# Altium schematic sheet Core48.SchDoc
size A4
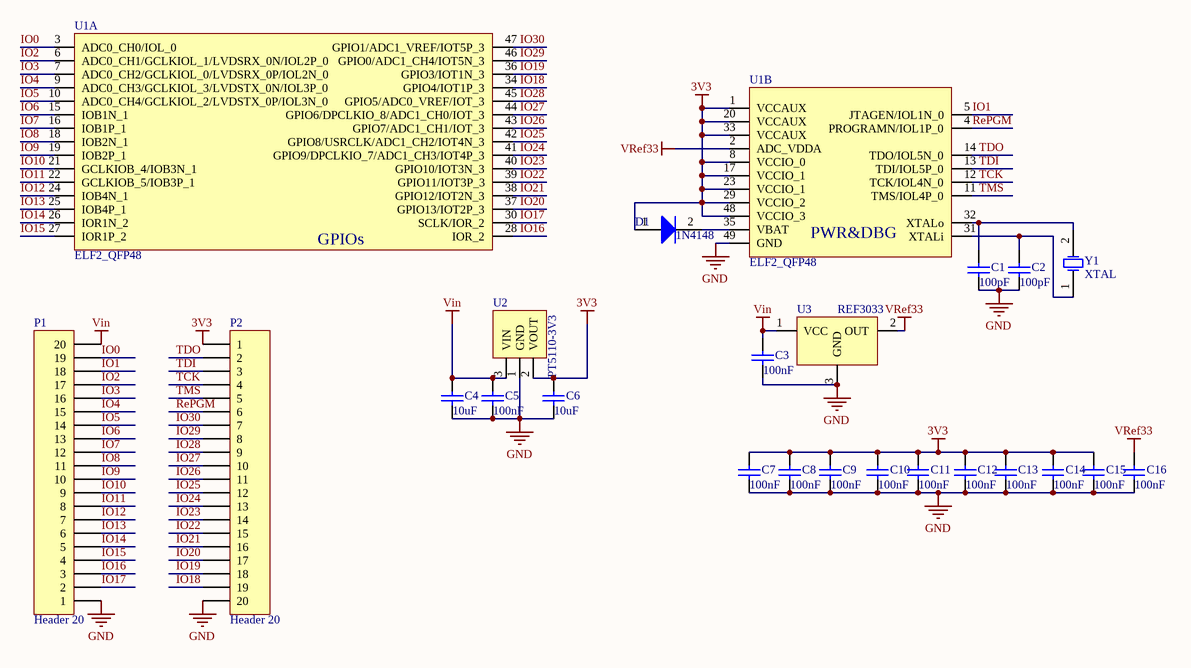
[diagram p0: Core48.SchDoc]

## Parts
C1  value 100pF  [0603C]  (hidden comment: Cap)
C2  value 100pF  [0603C]  (hidden comment: Cap)
C3  value 100nF  [0603C]  (hidden comment: Cap)
C4  value 10uF  [0603C]  (hidden comment: Cap)
C5  value 100nF  [0603C]  (hidden comment: Cap)
C6  value 10uF  [0603C]  (hidden comment: Cap)
C7  value 100nF  [0603C]  (hidden comment: Cap)
C8  value 100nF  [0603C]  (hidden comment: Cap)
C9  value 100nF  [0603C]  (hidden comment: Cap)
C10  value 100nF  [0603C]  (hidden comment: Cap)
C11  value 100nF  [0603C]  (hidden comment: Cap)
C12  value 100nF  [0603C]  (hidden comment: Cap)
C13  value 100nF  [0603C]  (hidden comment: Cap)
C14  value 100nF  [0603C]  (hidden comment: Cap)
C15  value 100nF  [0603C]  (hidden comment: Cap)
C16  value 100nF  [0603C]  (hidden comment: Cap)
D1  1N4148  [6-0805_Diode]
P1  Header 20  [HDR1X20]
P2  Header 20  [HDR1X20]
U1  ELF2_QFP48  [TSQFP48-7*7]  (parts A,B of 2)
U2  PT5110-3V3  [SOT-89-3]
U3  REF3033  [SOT23]
Y1  XTAL  [XTAL-5032]

## Nets
3V3: C6.2 C7.2 C8.2 C9.2 C10.2 C11.2 C12.2 C13.2 C14.2 C15.2 D1.1(A) P2.1 U1.1(VCCAUX) U1.8(VCCIO_0) U1.17(VCCIO_1) U1.20(VCCAUX) U1.23(VCCIO_1) U1.29(VCCIO_2) U1.33(VCCAUX) U1.48(VCCIO_3) U2.2(VOUT)
GND: C1.1 C2.1 C3.1 C4.1 C5.1 C6.1 C7.1 C8.1 C9.1 C10.1 C11.1 C12.1 C13.1 C14.1 C15.1 C16.1 P1.1 P2.20 U1.49(GND) U2.1(GND) U3.3(GND)
Vin: C3.2 C4.2 C5.2 P1.20 U2.3(VIN) U3.1(VCC)
VRef33: C16.2 U1.2(ADC_VDDA) U3.2(OUT)
IO0: P1.19 U1.3(ADC0_CH0/IOL_0)
IO1: P1.18 U1.5(JTAGEN/IOL1N_0)
IO2: P1.17 U1.6(ADC0_CH1/GCLKIOL_1/LVDSRX_0N/IOL2P_0)
IO3: P1.16 U1.7(ADC0_CH2/GCLKIOL_0/LVDSRX_0P/IOL2N_0)
IO4: P1.15 U1.9(ADC0_CH3/GCLKIOL_3/LVDSTX_0N/IOL3P_0)
IO5: P1.14 U1.10(ADC0_CH4/GCLKIOL_2/LVDSTX_0P/IOL3N_0)
IO6: P1.13 U1.15(IOB1N_1)
IO7: P1.12 U1.16(IOB1P_1)
IO8: P1.11 U1.18(IOB2N_1)
IO9: P1.10 U1.19(IOB2P_1)
IO10: P1.9 U1.21(GCLKIOB_4/IOB3N_1)
IO11: P1.8 U1.22(GCLKIOB_5/IOB3P_1)
IO12: P1.7 U1.24(IOB4N_1)
IO13: P1.6 U1.25(IOB4P_1)
IO14: P1.5 U1.26(IOR1N_2)
IO15: P1.4 U1.27(IOR1P_2)
IO16: P1.3 U1.28(IOR_2)
IO17: P1.2 U1.30(SCLK/IOR_2)
IO18: P2.19 U1.34(GPIO4/IOT1P_3)
IO19: P2.18 U1.36(GPIO3/IOT1N_3)
IO20: P2.17 U1.37(GPIO13/IOT2P_3)
IO21: P2.16 U1.38(GPIO12/IOT2N_3)
IO22: P2.15 U1.39(GPIO11/IOT3P_3)
IO23: P2.14 U1.40(GPIO10/IOT3N_3)
IO24: P2.13 U1.41(GPIO9/DPCLKIO_7/ADC1_CH3/IOT4P_3)
IO25: P2.12 U1.42(GPIO8/USRCLK/ADC1_CH2/IOT4N_3)
IO26: P2.11 U1.43(GPIO7/ADC1_CH1/IOT_3)
IO27: P2.10 U1.44(GPIO6/DPCLKIO_8/ADC1_CH0/IOT_3)
IO28: P2.9 U1.45(GPIO5/ADC0_VREF/IOT_3)
IO29: P2.8 U1.46(GPIO0/ADC1_CH4/IOT5N_3)
IO30: P2.7 U1.47(GPIO1/ADC1_VREF/IOT5P_3)
RePGM: P2.6 U1.4(PROGRAMN/IOL1P_0)
TCK: P2.4 U1.12(TCK/IOL4N_0)
TDI: P2.3 U1.13(TDI/IOL5P_0)
TDO: P2.2 U1.14(TDO/IOL5N_0)
TMS: P2.5 U1.11(TMS/IOL4P_0)
NetC1_2: C1.2 U1.32(XTALo) Y1.2(OSC2)
NetC2_2: C2.2 U1.31(XTALi) Y1.1(OSC1)
NetD1_2: D1.2(K) U1.35(VBAT)

## Notes on the sheet
- (in symbol ELF2_QFP48, part A) GPIOs
- (in symbol ELF2_QFP48, part B) PWR&DBG

## Library data of the parts
C1-C16 = Cap: Capacitor; Published: 8-Jun-2000; LatestRevisionDate: 17-Jul-2002; LatestRevisionNote: Re-released for DXP Platform.; PackageReference: RAD-0.3; Publisher: Altium Limited; PackageDescription: Radial Cap, Thru-Hole; 2 Leads; 0.3 in Pin Spacing
D1 = Diode: Default Diode; Published: 8-Jun-2000; LatestRevisionDate: 17-Jul-2002; LatestRevisionNote: Re-released for DXP Platform.; PackageVersion: Sep-1996; PackageReference: SMC; Publisher: Altium Limited; PackageDescription: DO-214-AB/SMC; 2 C-Bend Leads; Body 7.9 x 5.9 mm, inc. leads (LxW); Code_JEDEC: DO-214-AB
P1 P2 = Header 20: Header, 20-Pin; LatestRevisionDate: 17-Jul-2002; LatestRevisionNote: Re-released for DXP Platform.; Publisher: Altium Limited
U2 = PT5110
U3 = REF30xx
Y1 = XTAL: Crystal Oscillator; Published: 8-Jun-2000; LatestRevisionDate: 17-Jul-2002; LatestRevisionNote: Re-released for DXP Platform.; PackageReference: R38; Publisher: Altium Limited; PackageDescription: Crystal, Thru-Hole; 2 Leads; Body 3.1 x 8.2 mm (Dia.xH)